# Altium schematic sheet Power Supply.SchDoc
size A3; SheetNumber: 4; SheetTotal: 4; SPICEModelCachePMWPNHZN: <root> / <DocumentId>PMWPNHZN</DocumentId> / </root>
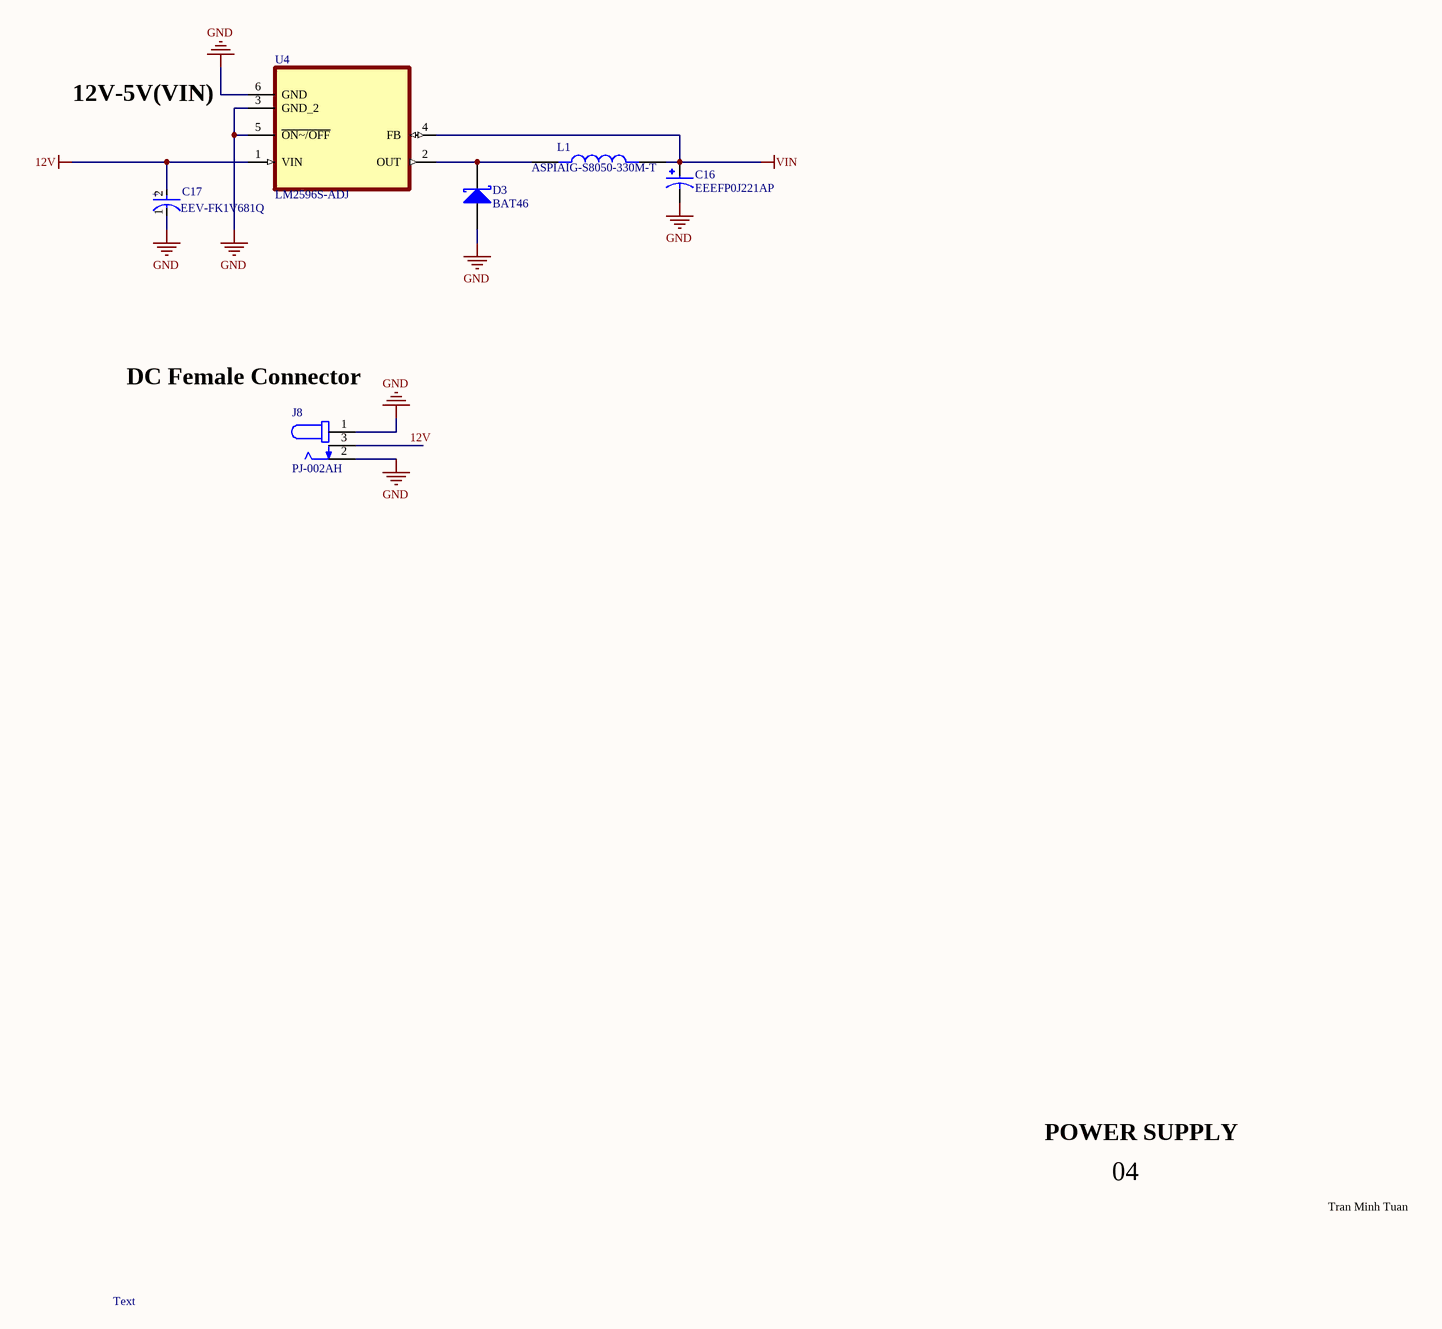
[diagram p0: Power Supply.SchDoc]

## Parts
C16  EEEFP0J221AP  [CAP_EEEFP0J221AP]
C17  EEV-FK1V681Q  [FP-FKH13-MFG]
D3  BAT46  [STM-DO-35-2]
J8  PJ-002AH  [CUI_PJ-002AH]
L1  ASPIAIG-S8050-330M-T  [IND_ASPIAIG-S8050-330M-T]
U4  LM2596S-ADJ  [TO170P1435X465-6N]

## Nets
12V: C17.2(A) J8.3 U4.1(VIN)
GND: C16.2 C17.1(C) D3.1(A) J8.1 J8.2 U4.3(GND_2) U4.5(~{ON~/OFF}) U4.6(GND)
VIN: C16.1 L1.2 U4.4(FB)
NetD3_2: D3.2(K) L1.1 U4.2(OUT)

## Notes on the sheet
- 12V-5V(VIN)
- (near J8) DC Female Connector
- POWER SUPPLY
- 04
- Tran Minh Tuan
- Text
- (in symbol CMP-05427-002172-1) +

## Library data of the parts
C16 = EEEFP0J221AP: CAP ALUM 220UF 20% 6.3V SMD; MF: Panasonic; SnapEDA_Link: https://www.snapeda.com/parts/EEEFP0J221AP/Panasonic/view-part/?ref=snap; Package: RADIAL-2 Panasonic; Value: *; MP: EEEFP0J221AP; Check_prices: https://www.snapeda.com/parts/EEEFP0J221AP/Panasonic/view-part/?ref=eda
C17 = CMP-05427-002172-1: CAP ALUM 680UF 20% 35V SMD; Ripple Current (AC): 1.1A; Life (Hours): 5000Hour; Material: Aluminium; ESR (Equivalent Series Resistance): 60mR; Leakage Current: 3uA; Max Operating Temperature: 105°C; Min Operating Temperature: -55°C; Reach SVHC Compliant: Yes; Radiation Hardening: No; Length: 14mm; Package Quantity: 200; Width: 900um; Mount: Surface Mount; Ripple Current: 1.1A; Lead Free: Lead Free; Case/Package: Radial; Voltage Rating (DC): 35V; Termination: SMD/SMT; Capacitance: 680uF; Series: FK; Packaging: Tape and Reel; Voltage: 35V; Height: 13.5mm; Construction: Cylindrical; Voltage Rating: 35V; Ratings: AEC-Q200; Contact Plating: Tin; Impedance: 60mR; Height - Seated (Max): 0.531inch; Diameter: 12.5mm; RoHS Compliant: Yes; Tolerance: 20%
D3 = CMP-2000-05926-1: Small Signal Schottky Diode, 150 mA, 100 V, -65 to 125 degC, 2-Pin DO-35, RoHS, Tape and Reel; Manufacturer: STMicroelectronics; SVHC: NoSVHC(15-Jun-2015); Diode Configuration: Single; No. of Pins: 2Pins; Forward Surge Current Ifsm Max: 750mA; Repetitive Reverse Voltage Vrrm Max: 100V; Diode Case Style: DO-204AH; Forward Voltage VF Max: 1V; Forward Current If(AV): 150mA; Manufacturer URL: http://www.st.com/; Packaging: Tape&Reel; Package Reference: DO-35-2; Datasheet URL: http://www.st.com/content/ccc/resource/technical/document/datasheet/group1/11/76/e4/a3/df/07/49/14/CD00000767/files/CD00000767.pdf/jcr:content/translations/en.CD00000767.pdf; Diode Type: Schottky; Mounting Technology: ThroughHole; Package Description: 2-Pin Axial Lead, Dia 1.765 mm, Body Length 3.775 mm; Product Range: -; Datasheet Version: Rev. 2.1, 10/2001; Operating Temperature Max: 125°C
J8 = PJ-002AH: 2.0 x 6.5 mm, 5.0 A, Horizontal, Through Hole, Dc Power Jack Connector; MF: Same Sky; SnapEDA_Link: https://www.snapeda.com/parts/PJ-002AH/Same+Sky/view-part/?ref=snap; Package: None; Value: *; MP: PJ-002AH; Check_prices: https://www.snapeda.com/parts/PJ-002AH/Same+Sky/view-part/?ref=eda
L1 = ASPIAIG-S8050-330M-T: Inductor Power Shielded Wirewound 33uH 20% 100KHz Ferrite 2A 122mOhm DCR 3131 Automotive T/R; MF: Abracon LLC; MP: ASPIAIG-S8050-330M-T; SnapEDA_Link: https://www.snapeda.com/parts/ASPIAIG-S8050-330M-T/Abracon+LLC/view-part/?ref=snap; Value: *; Package: Nonstandard Abracon; Price: None; Availability: In Stock; Purchase-URL: https://pricing.snapeda.com/search/part/ASPIAIG-S8050-330M-T/?ref=eda; Check_prices: https://www.snapeda.com/parts/ASPIAIG-S8050-330M-T/Abracon+LLC/view-part/?ref=eda
U4 = LM2596S-ADJ: Buck Switching Regulator IC Positive Adjustable 1.2V 1 Output 3A TO-263-6, DÂ²Pak (5 Leads + Tab), TO-263BA; MF: UMW; SnapEDA_Link: https://www.snapeda.com/parts/LM2596S-ADJ/Umwelt+Sensor+Teknik/view-part/?ref=snap; Package: None; Value: *; MP: LM2596S-ADJ; Check_prices: https://www.snapeda.com/parts/LM2596S-ADJ/Umwelt+Sensor+Teknik/view-part/?ref=eda